# Altium schematic sheet 00 Block diagram.SchDoc
size A4; DocumentNumber: 3; Revision: V1.0; SheetNumber: 3; SheetTotal: 11; Stage: DRAFT
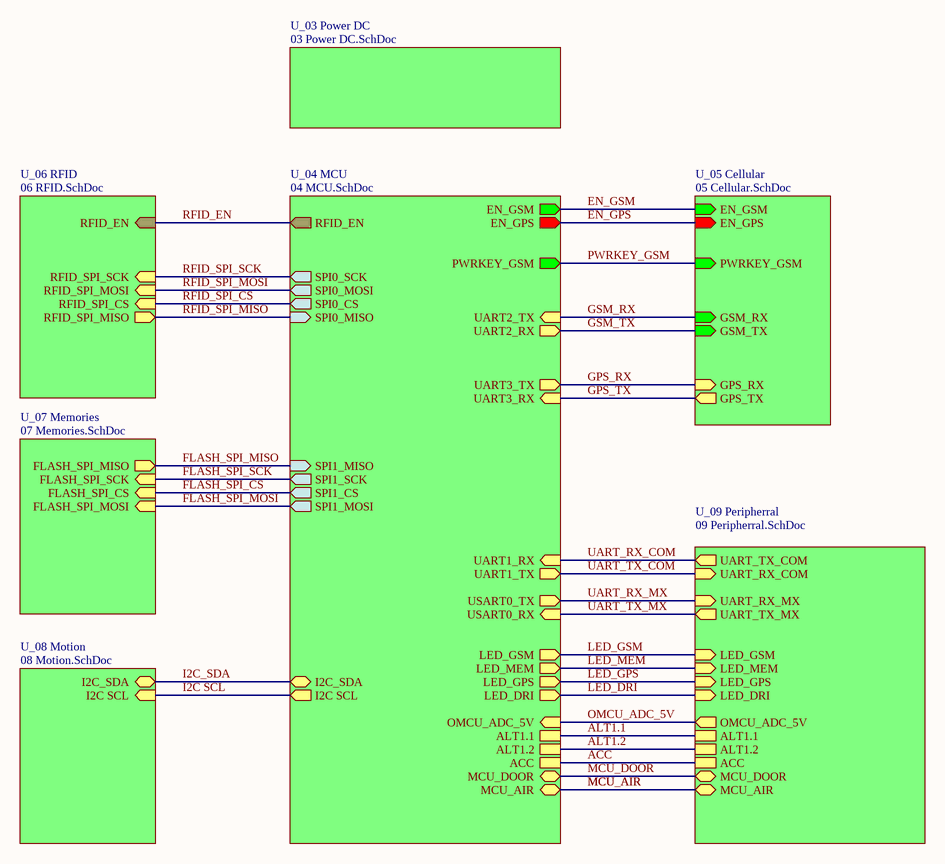
[diagram p0: 00 Block diagram.SchDoc]

## Sub-sheets
U_03 Power DC = 03 Power DC.SchDoc: no entries
U_04 MCU = 04 MCU.SchDoc: SPI0_MISO (in), SPI0_CS (out), SPI1_SCK (out), SPI1_MISO (in), SPI1_MOSI (out), SPI1_CS (out), EN_GPS (out), RFID_EN (out), PWRKEY_GSM (out), EN_GSM (out), LED_MEM (out), LED_GPS (out), LED_DRI (out), LED_GSM (out), UART2_TX (in), UART2_RX (out), SPI0_SCK (out), SPI0_MOSI (out), OMCU_ADC_5V (in), ALT1.1, ALT1.2, ACC, UART3_TX (out), UART3_RX (in), I2C_SDA (bidir), I2C SCL (out), MCU_DOOR (bidir), USART0_TX (out), USART0_RX (in), UART1_TX (out), UART1_RX (in), MCU_AIR (bidir)
U_05 Cellular = 05 Cellular.SchDoc: EN_GSM (in), EN_GPS (in), GSM_RX (in), PWRKEY_GSM (in), GSM_TX (in), GPS_RX (in), GPS_TX (out)
U_06 RFID = 06 RFID.SchDoc: RFID_EN (in), RFID_SPI_SCK (in), RFID_SPI_MISO (out), RFID_SPI_MOSI (in), RFID_SPI_CS (in)
U_07 Memories = 07 Memories.SchDoc: FLASH_SPI_SCK (in), FLASH_SPI_MISO (out), FLASH_SPI_MOSI (in), FLASH_SPI_CS (in)
U_08 Motion = 08 Motion.SchDoc: I2C_SDA (bidir), I2C SCL (in)
U_09 Peripherral = 09 Peripherral.SchDoc: LED_GSM (in), LED_MEM (in), LED_GPS (in), LED_DRI (in), ALT1.1, ALT1.2, ACC, OMCU_ADC_5V (out), MCU_DOOR (bidir), UART_RX_COM (in), UART_TX_COM (out), UART_TX_MX (out), UART_RX_MX (in), MCU_AIR (bidir)

## Nets
ACC: sheet U_04 MCU/ACC, sheet U_09 Peripherral/ACC
ALT1.1: sheet U_04 MCU/ALT1.1, sheet U_09 Peripherral/ALT1.1
ALT1.2: sheet U_04 MCU/ALT1.2, sheet U_09 Peripherral/ALT1.2
EN_GPS: sheet U_04 MCU/EN_GPS, sheet U_05 Cellular/EN_GPS
EN_GSM: sheet U_04 MCU/EN_GSM, sheet U_05 Cellular/EN_GSM
FLASH_SPI_CS: sheet U_04 MCU/SPI1_CS, sheet U_07 Memories/FLASH_SPI_CS
FLASH_SPI_MISO: sheet U_04 MCU/SPI1_MISO, sheet U_07 Memories/FLASH_SPI_MISO
FLASH_SPI_MOSI: sheet U_04 MCU/SPI1_MOSI, sheet U_07 Memories/FLASH_SPI_MOSI
FLASH_SPI_SCK: sheet U_04 MCU/SPI1_SCK, sheet U_07 Memories/FLASH_SPI_SCK
GPS_RX: sheet U_04 MCU/UART3_TX, sheet U_05 Cellular/GPS_RX
GPS_TX: sheet U_04 MCU/UART3_RX, sheet U_05 Cellular/GPS_TX
GSM_RX: sheet U_04 MCU/UART2_TX, sheet U_05 Cellular/GSM_RX
GSM_TX: sheet U_04 MCU/UART2_RX, sheet U_05 Cellular/GSM_TX
I2C SCL: sheet U_04 MCU/I2C SCL, sheet U_08 Motion/I2C SCL
I2C_SDA: sheet U_04 MCU/I2C_SDA, sheet U_08 Motion/I2C_SDA
LED_DRI: sheet U_04 MCU/LED_DRI, sheet U_09 Peripherral/LED_DRI
LED_GPS: sheet U_04 MCU/LED_GPS, sheet U_09 Peripherral/LED_GPS
LED_GSM: sheet U_04 MCU/LED_GSM, sheet U_09 Peripherral/LED_GSM
LED_MEM: sheet U_04 MCU/LED_MEM, sheet U_09 Peripherral/LED_MEM
MCU_AIR: sheet U_04 MCU/MCU_AIR, sheet U_09 Peripherral/MCU_AIR
MCU_DOOR: sheet U_04 MCU/MCU_DOOR, sheet U_09 Peripherral/MCU_DOOR
OMCU_ADC_5V: sheet U_04 MCU/OMCU_ADC_5V, sheet U_09 Peripherral/OMCU_ADC_5V
PWRKEY_GSM: sheet U_04 MCU/PWRKEY_GSM, sheet U_05 Cellular/PWRKEY_GSM
RFID_EN: sheet U_04 MCU/RFID_EN, sheet U_06 RFID/RFID_EN
RFID_SPI_CS: sheet U_04 MCU/SPI0_CS, sheet U_06 RFID/RFID_SPI_CS
RFID_SPI_MISO: sheet U_04 MCU/SPI0_MISO, sheet U_06 RFID/RFID_SPI_MISO
RFID_SPI_MOSI: sheet U_04 MCU/SPI0_MOSI, sheet U_06 RFID/RFID_SPI_MOSI
RFID_SPI_SCK: sheet U_04 MCU/SPI0_SCK, sheet U_06 RFID/RFID_SPI_SCK
UART_RX_COM: sheet U_04 MCU/UART1_RX, sheet U_09 Peripherral/UART_TX_COM
UART_RX_MX: sheet U_04 MCU/USART0_TX, sheet U_09 Peripherral/UART_RX_MX
UART_TX_COM: sheet U_04 MCU/UART1_TX, sheet U_09 Peripherral/UART_RX_COM
UART_TX_MX: sheet U_04 MCU/USART0_RX, sheet U_09 Peripherral/UART_TX_MX

## Notes on the sheet
- Title
- Size:
- Date:
- A4
- Number:
- Time:
- Revision:
- Sheet
- of
- File: